# Altium project DAQ_2025.PrjPcb
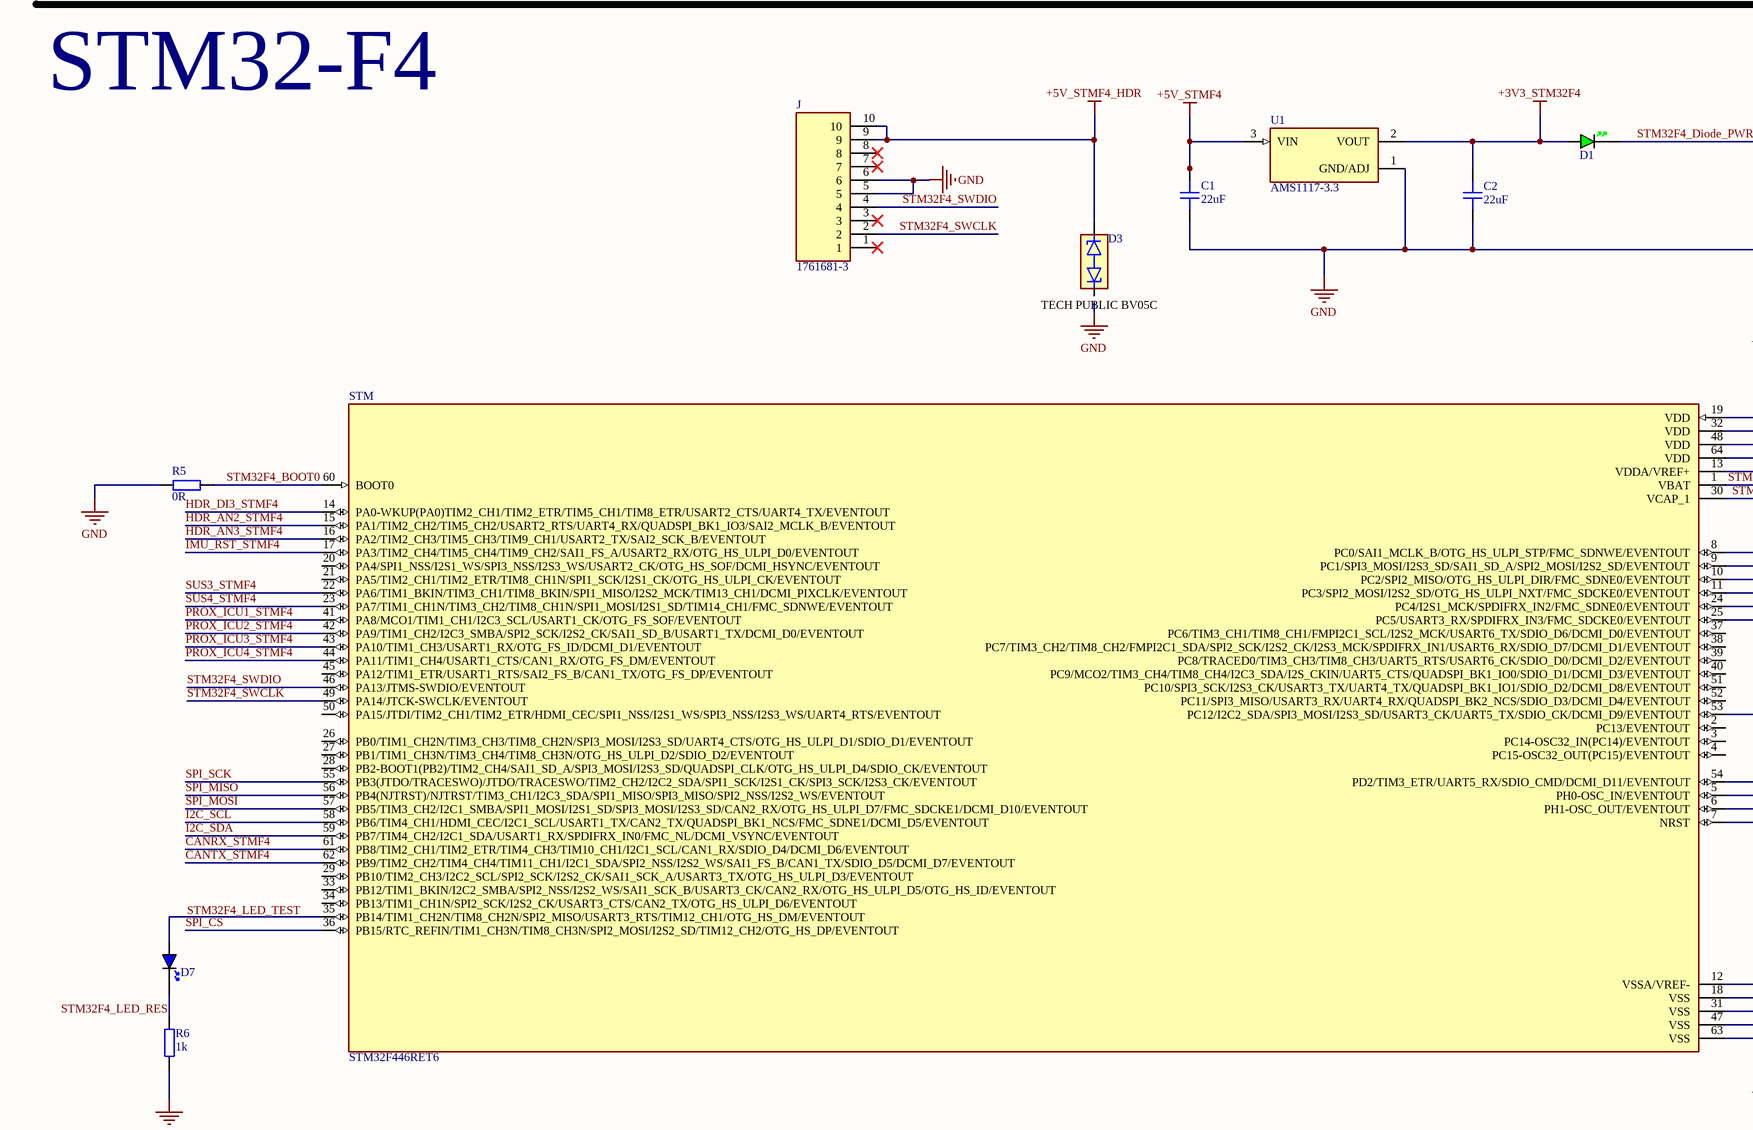
[diagram p0: DAQ_Sch.SchDoc, top left]
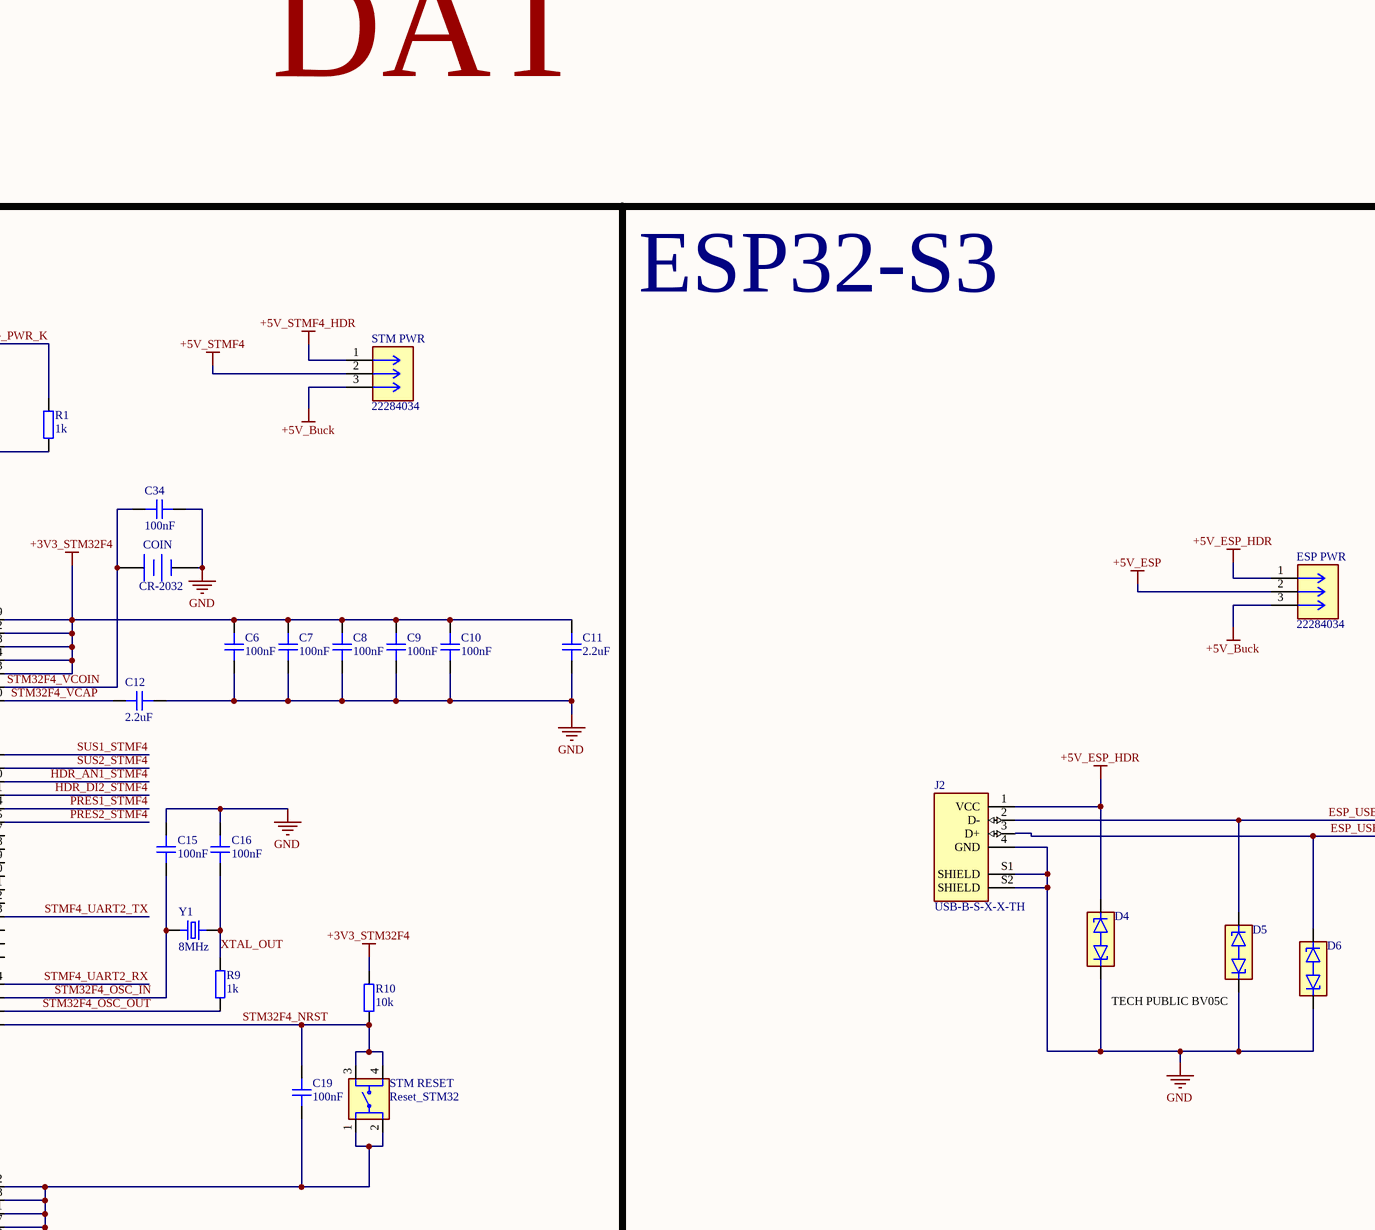
[diagram p1: DAQ_Sch.SchDoc, top middle]
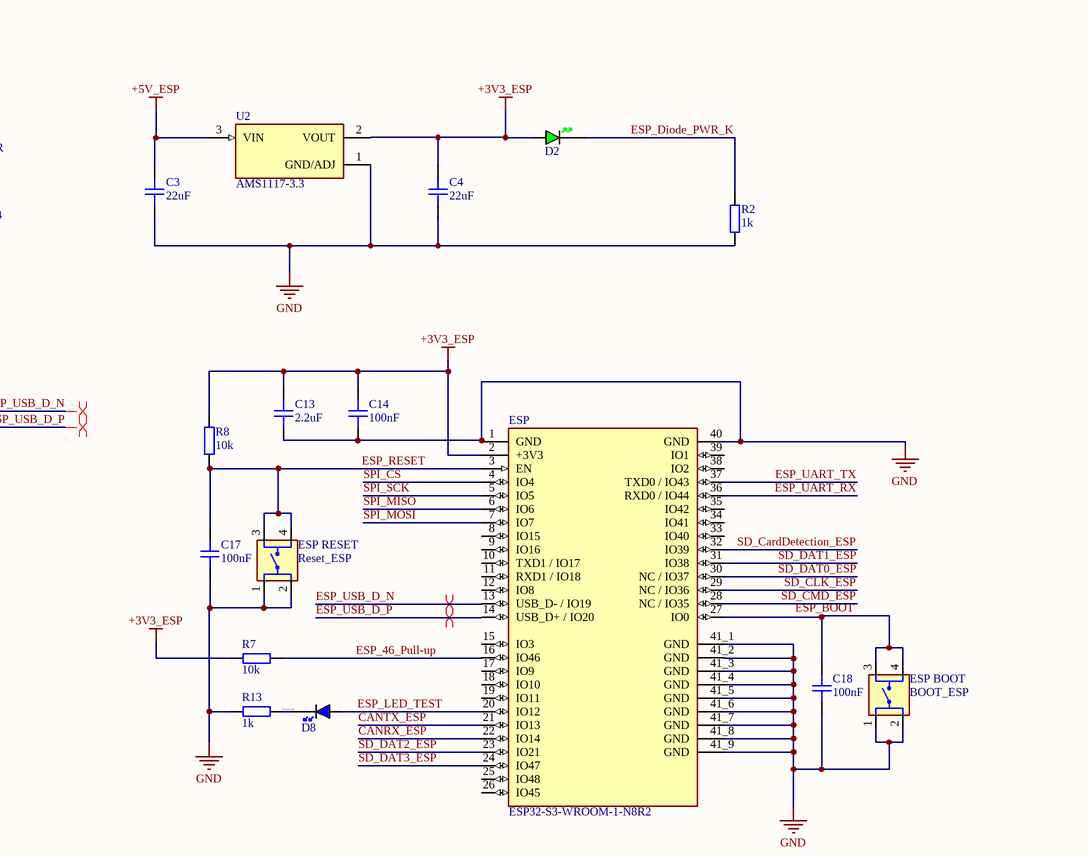
[diagram p2: DAQ_Sch.SchDoc, top right]
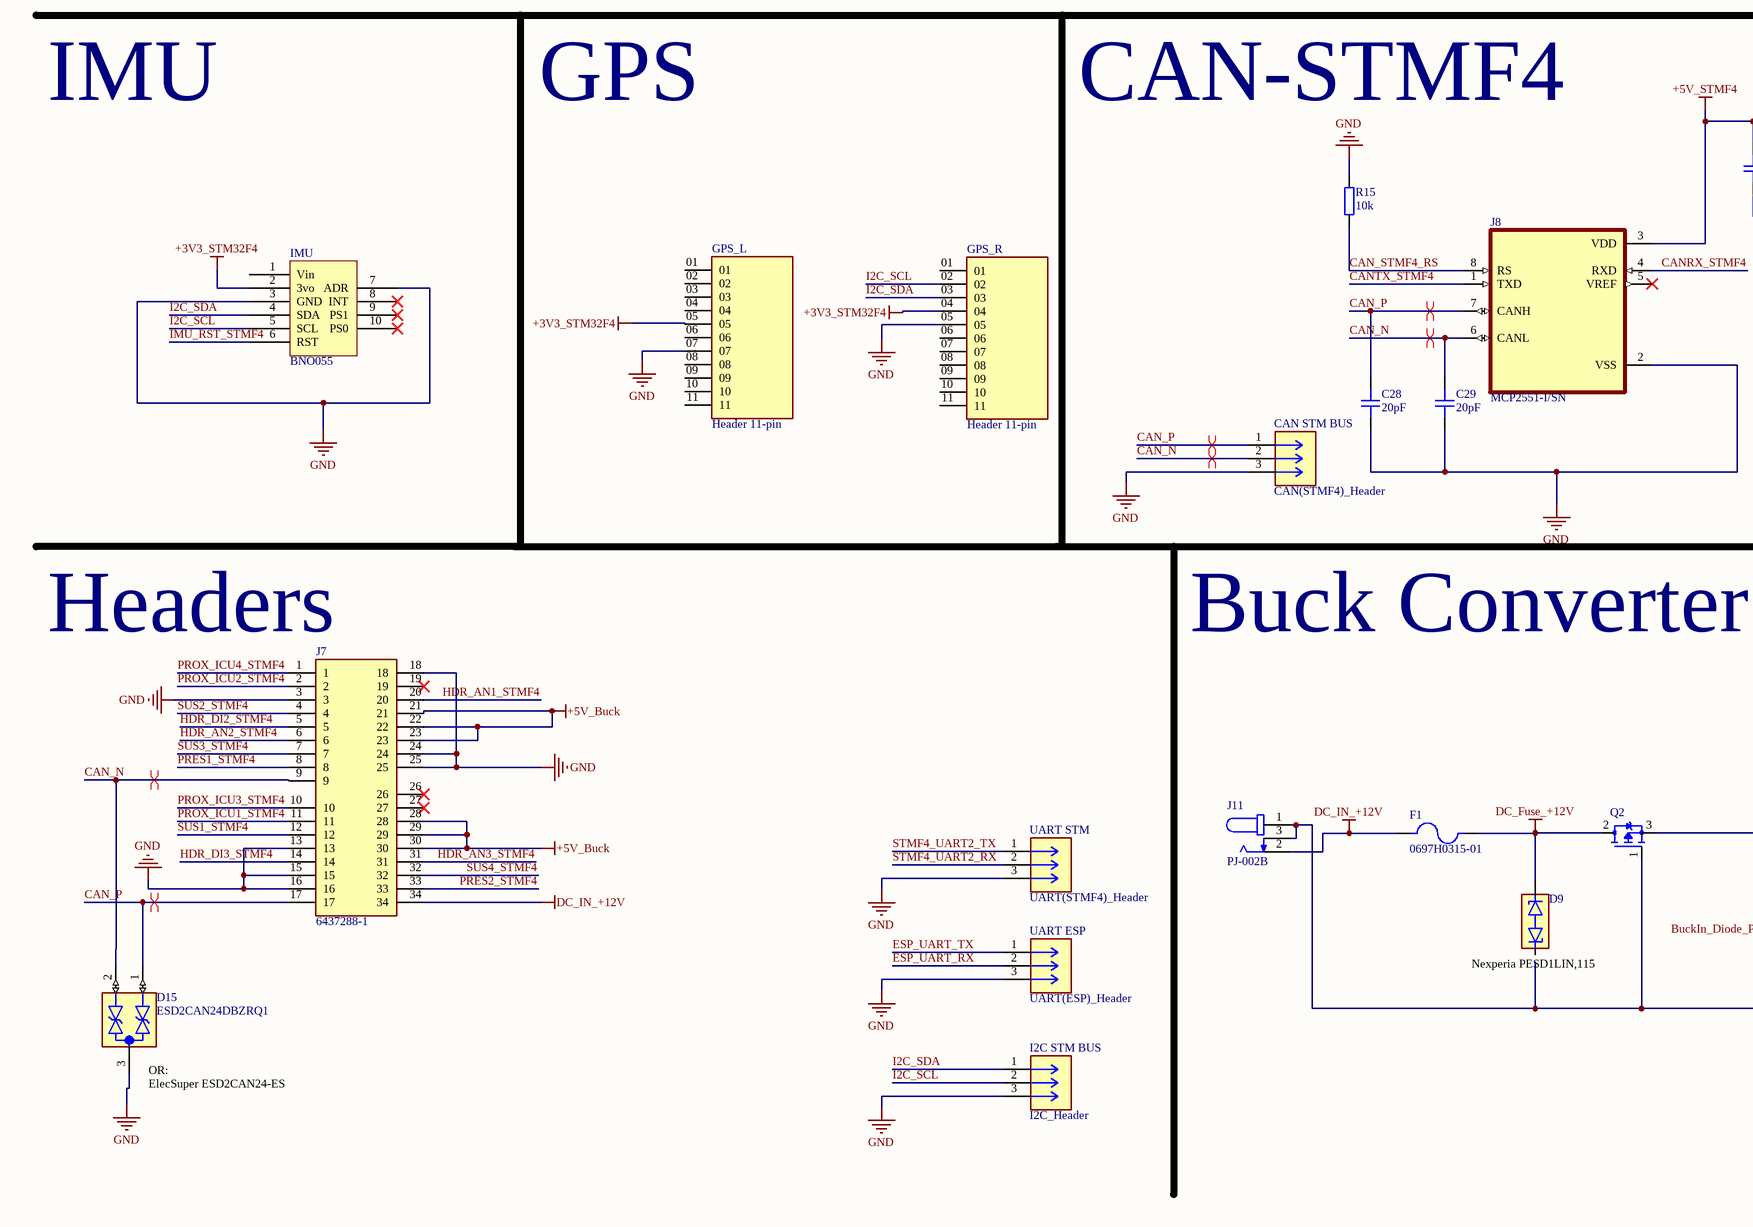
[diagram p3: DAQ_Sch.SchDoc, bottom left]
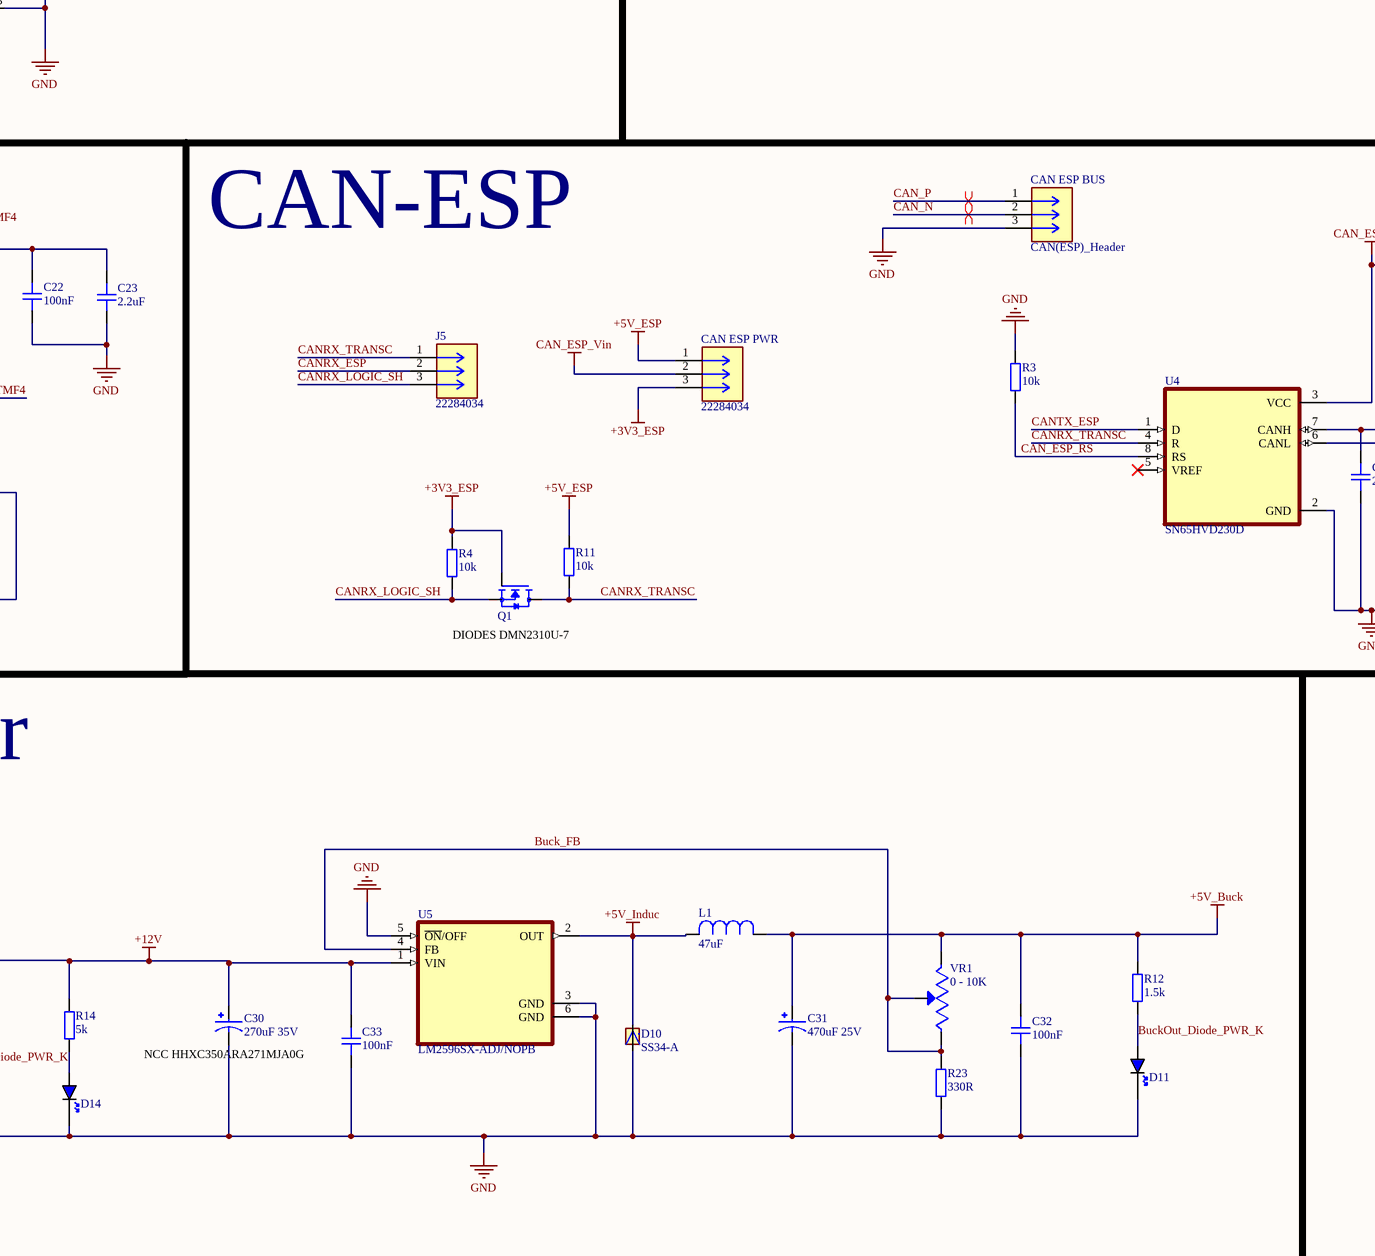
[diagram p4: DAQ_Sch.SchDoc, bottom middle]
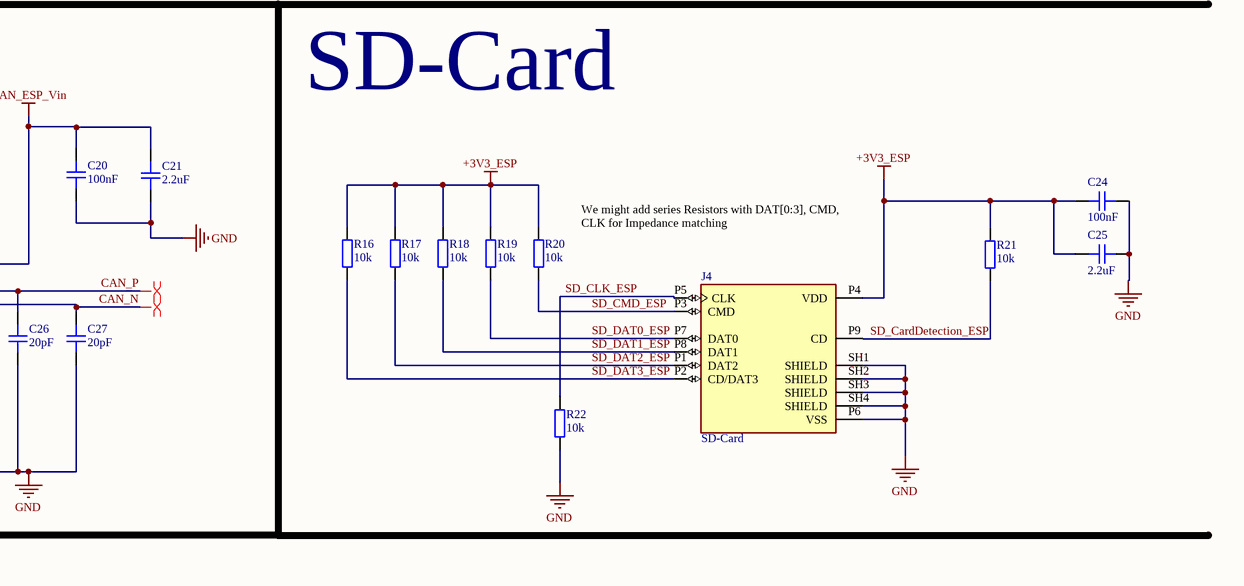
[diagram p5: DAQ_Sch.SchDoc, bottom right]
1 sheet, 103 parts. Net scope: global (net labels, ports and power ports of the same name join across sheets).
Board file: DAQ_Doc.PcbDoc

## Sheet DAQ_Sch.SchDoc
size D; SheetNumber: 1; SheetTotal: 1

### Parts
C1  22uF  [CAP_0805]
C2  22uF  [CAP_0805]
C3  22uF  [CAP_0805]
C4  22uF  [CAP_0805]
C6  100nF  [CAP_0805]
C7  100nF  [CAP_0805]
C8  100nF  [CAP_0805]
C9  100nF  [CAP_0805]
C10  100nF  [CAP_0805]
C11  2.2uF  [CAP_0805]
C12  2.2uF  [CAP_0805]
C13  2.2uF  [CAP_0805]
C14  100nF  [CAP_0805]
C15  100nF  [CAP_0805]
C16  100nF  [CAP_0805]
C17  100nF  [CAP_0805]
C18  100nF  [CAP_0805]
C19  100nF  [CAP_0805]
C20  100nF  [CAP_0805]
C21  2.2uF  [CAP_0805]
C22  100nF  [CAP_0805]
C23  2.2uF  [CAP_0805]
C24  100nF  [CAP_0805]
C25  2.2uF  [CAP_0805]
C26  20pF  [CAP_0805]
C27  20pF  [CAP_0805]
C28  20pF  [CAP_0805]
C29  20pF  [CAP_0805]
C30  270uF 35V  [CAP_EEEFT1E471AP]
C31  470uF 25V  [CAP_EEEFT1E471AP]
C32  100nF  [CAP_0805]
C33  100nF  [CAP_0805]
C34  100nF  [CAP_0805]
CAN_ESP_BUS  CAN(ESP)_Header  [CONN_SD-42375-001_M320_03_MOL]
CAN_ESP_PWR  22284034  [CONN_SD-42375-001_M320_03_MOL]
CAN_STM_BUS  CAN(STMF4)_Header  [CONN_SD-42375-001_M320_03_MOL]
COIN  CR-2032  [PANA-CR-2032HFN]
D1  GREEN  [LED_0805_GREEN]  (value not drawn)
D2  GREEN  [LED_0805_GREEN]  (value not drawn)
D3  5V-TVS  [DIO_PESD1LIN]  (value not drawn)
D4  5V-TVS  [DIO_PESD1LIN]  (value not drawn)
D5  5V-TVS  [DIO_PESD1LIN]  (value not drawn)
D6  5V-TVS  [DIO_PESD1LIN]  (value not drawn)
D7  BLUE  [LED_0805_BLUE]  (value not drawn)
D8  BLUE  [LED_0805_BLUE]  (value not drawn)
D9  5V-TVS  [DIO_PESD1LIN]  (value not drawn)
D10  SS34-A  [DO-214AC]
D11  BLUE  [LED_0805_BLUE]  (value not drawn)
D14  BLUE  [LED_0805_BLUE]  (value not drawn)
D15  ESD2CAN24DBZRQ1  [SOT95P237X112-3N]
ESP  ESP32-S3-WROOM-1-N8R2  [ESP32-S3-WROOM-1_NO-KEEPOUT]
ESP_BOOT  BOOT_ESP  [SW_FSM8JH]
ESP_PWR  22284034  [CONN_SD-42375-001_M320_03_MOL]
ESP_RESET  Reset_ESP  [SW_FSM8JH]
F1  0697H0315-01  [FUSRR508W60L835T400H810]
GPS_L  Header 11-pin  [SAMTEC_MTSW-111-22-T-S-440]
GPS_R  Header 11-pin  [SAMTEC_MTSW-111-22-T-S-440]
I2C_STM_BUS  I2C_Header  [CONN_SD-42375-001_M320_03_MOL]
IMU  BNO055  [IMU]
J  1761681-3  [TE_1761681-3]
J2  USB-B-S-X-X-TH  [SAMTEC_USB-B-S-X-X-TH]
J4  SD-Card  [GCT_MEM2075-00-140-01-A]
J5  22284034  [CONN_SD-42375-001_M320_03_MOL]
J7  6437288-1  [TE_6437288-1]
J8  MCP2551-I/SN  [SOIC127P599X175-8N]
J11  PJ-002B  [CUI_PJ-002B]
L1  47uF  [IND_CDRH127/LDNP-470MC_SUM]
Q1  2N7002  [TRANS_2N7002]  (value not drawn)
Q2  IRF4905STRRPBF  [TRANS_IRF4905STRRPBF]  (value not drawn)
R1  1k  [RES_0805]
R2  1k  [RES_0805]
R3  10k  [RES_0805]
R4  10k  [RES_0805]
R5  0R  [RES_0805]
R6  1k  [RES_0805]
R7  10k  [RES_0805]
R8  10k  [RES_0805]
R9  1k  [RES_0805]
R10  10k  [RES_0805]
R11  10k  [RES_0805]
R12  1.5k  [RES_0805]
R13  1k  [RES_0805]
R14  5k  [RES_0805]
R15  10k  [RES_0805]
R16  10k  [RES_0805]
R17  10k  [RES_0805]
R18  10k  [RES_0805]
R19  10k  [RES_0805]
R20  10k  [RES_0805]
R21  10k  [RES_0805]
R22  10k  [RES_0805]
R23  330R  [RES_0805]
STM  STM32F446RET6  [QFP50P1200X1200X160-64N]
STM_PWR  22284034  [CONN_SD-42375-001_M320_03_MOL]
STM_RESET  Reset_STM32  [SW_FSM8JH]
U1  AMS1117-3.3  [SOT229P700X180-4N]
U2  AMS1117-3.3  [SOT229P700X180-4N]
U4  SN65HVD230D  [SOIC127P599X175-8N]
U5  LM2596SX-ADJ/NOPB  [VREG_LM2596SX-ADJ/NOPB]
UART_ESP  UART(ESP)_Header  [CONN_SD-42375-001_M320_03_MOL]
UART_STM  UART(STMF4)_Header  [CONN_SD-42375-001_M320_03_MOL]
VR1  0 - 10K  [TRIM_3296W-1-103LF]
Y1  8MHz  [XTAL_ECS-80-20-5PVX]

### Nets
+3V3_ESP: C4.2 C13.1 C14.1 C24.2 C25.2 CAN_ESP_PWR.3 D2.A ESP.2(+3V3) J4.P4(VDD) Q1.1(G) R4.2 R7.1 R8.2 R16.2 R17.2 R18.2 R19.2 R20.2 R21.2 U2.2(VOUT)
+3V3_STM32F4: C2.2 C6.2 C7.2 C8.2 C9.2 C10.2 C11.2 D1.A GPS_L.05 GPS_R.04 IMU.2(3vo) R10.2 STM.13(VDDA/VREF+) STM.19(VDD) STM.32(VDD) STM.48(VDD) STM.64(VDD) U1.2(VOUT)
+5V_Buck: C31.1 C32.2 ESP_PWR.3 J7.21 J7.22 J7.23 J7.28 J7.29 J7.30 L1.1 R12.2 STM_PWR.3 VR1.3(CW)
+5V_ESP: C3.2 CAN_ESP_PWR.1 ESP_PWR.2 R11.2 U2.3(VIN)
+5V_ESP_HDR: D4.2 ESP_PWR.1 J2.1(VCC)
+5V_Induc: D10.C L1.2 U5.2(OUT)
+5V_STMF4: C1.2 C22.2 C23.2 J8.3(VDD) STM_PWR.2 U1.3(VIN)
+5V_STMF4_HDR: D3.2 J.9 J.10 STM_PWR.1
+12V: C30.1 C33.2 Q2.3(S) R14.2 U5.1(VIN)
CAN_ESP_Vin: C20.2 C21.2 CAN_ESP_PWR.2 U4.3(VCC)
DC_Fuse_+12V: D9.2 F1.2 Q2.2(D)
DC_IN_+12V: F1.1 J7.34 J11.2
GND: C1.1 C2.1 C3.1 C4.1 C6.1 C7.1 C8.1 C9.1 C10.1 C11.1 C12.1 C13.2 C14.2 C15.2 C16.2 C17.2 C18.2 C19.1 C20.1 C21.1 C22.1 C23.1 C24.1 C25.1 C26.1 C27.1 C28.1 C29.1 C30.2 C31.2 C32.1 C33.1 C34.1 CAN_ESP_BUS.3 CAN_STM_BUS.3 COIN.2(-) D3.1 D4.1 D5.1 D6.1 D9.1 D10.A D11.K D14.K D15.3(GND) ESP.1(GND) ESP.40(GND) ESP.41_1(GND) ESP.41_2(GND) ESP.41_3(GND) ESP.41_4(GND) ESP.41_5(GND) ESP.41_6(GND) ESP.41_7(GND) ESP.41_8(GND) ESP.41_9(GND) ESP_BOOT.1 ESP_BOOT.2 ESP_RESET.1 ESP_RESET.2 GPS_L.07 GPS_R.05 I2C_STM_BUS.3 IMU.3(GND) IMU.7(ADR) J.5 J.6 J2.4(GND) J2.S1(SHIELD) J2.S2(SHIELD) J4.P6(VSS) J4.SH1(SHIELD) J4.SH2(SHIELD) J4.SH3(SHIELD) J4.SH4(SHIELD) J7.3 J7.13 J7.15 J7.16 J7.18 J7.24 J7.25 J8.2(VSS) J11.1 J11.3 Q2.1(G) R1.1 R2.2 R3.2 R5.1 R6.1 R13.2 R15.2 R22.1 R23.1 STM.12(VSSA/VREF-) STM.18(VSS) STM.31(VSS) STM.47(VSS) STM.63(VSS) STM_RESET.1 STM_RESET.2 U1.1(GND/ADJ) U2.1(GND/ADJ) U4.2(GND) U5.3(GND) U5.5(~{ON}/OFF) U5.6(GND) UART_ESP.3 UART_STM.3
Buck_FB: R23.2 U5.4(FB) VR1.1(CCW) VR1.2(WIPER)
BuckIn_Diode_PWR_K: D14.A R14.1
BuckOut_Diode_PWR_K: D11.A R12.1
CAN_ESP_RS: R3.1 U4.8(RS)
CAN_N: C27.2 C29.2 CAN_ESP_BUS.2 CAN_STM_BUS.2 D15.2(IO2) J7.9 J8.6(CANL) U4.6(CANL)
CAN_P: C26.2 C28.2 CAN_ESP_BUS.1 CAN_STM_BUS.1 D15.1(IO1) J7.17 J8.7(CANH) U4.7(CANH)
CAN_STMF4_RS: J8.8(RS) R15.1
CANRX_ESP: ESP.22(IO14) J5.2
CANRX_LOGIC_SH: J5.3 Q1.2(S) R4.1
CANRX_STMF4: J8.4(RXD) STM.61(PB8/TIM2_CH1/TIM2_ETR/TIM4_CH3/TIM10_CH1/I2C1_SCL/CAN1_RX/SDIO_D4/DCMI_D6/EVENTOUT)
CANRX_TRANSC: J5.1 Q1.3(D) R11.1 U4.4(R)
CANTX_ESP: ESP.21(IO13) U4.1(D)
CANTX_STMF4: J8.1(TXD) STM.62(PB9/TIM2_CH2/TIM4_CH4/TIM11_CH1/I2C1_SDA/SPI2_NSS/I2S2_WS/SAI1_FS_B/CAN1_TX/SDIO_D5/DCMI_D7/EVENTOUT)
ESP_46_Pull-up: ESP.16(IO46) R7.2
ESP_BOOT: C18.1 ESP.27(IO0) ESP_BOOT.3 ESP_BOOT.4
ESP_Diode_PWR_K: D2.K R2.1
ESP_LED_RES: D8.K R13.1
ESP_LED_TEST: D8.A ESP.20(IO12)
ESP_RESET: C17.1 ESP.3(EN) ESP_RESET.3 ESP_RESET.4 R8.1
ESP_UART_RX: ESP.36(RXD0_/_IO44) UART_ESP.2
ESP_UART_TX: ESP.37(TXD0_/_IO43) UART_ESP.1
ESP_USB_D_N: D5.2 ESP.13(USB_D-_/_IO19) J2.2(D-)
ESP_USB_D_P: D6.2 ESP.14(USB_D+_/_IO20) J2.3(D+)
HDR_AN1_STMF4: J7.20 STM.10(PC2/SPI2_MISO/OTG_HS_ULPI_DIR/FMC_SDNE0/EVENTOUT)
HDR_AN2_STMF4: J7.6 STM.15(PA1/TIM2_CH2/TIM5_CH2/USART2_RTS/UART4_RX/QUADSPI_BK1_IO3/SAI2_MCLK_B/EVENTOUT)
HDR_AN3_STMF4: J7.31 STM.16(PA2/TIM2_CH3/TIM5_CH3/TIM9_CH1/USART2_TX/SAI2_SCK_B/EVENTOUT)
HDR_DI2_STMF4: J7.5 STM.11(PC3/SPI2_MOSI/I2S2_SD/OTG_HS_ULPI_NXT/FMC_SDCKE0/EVENTOUT)
HDR_DI3_STMF4: J7.14 STM.14(PA0-WKUP(PA0)TIM2_CH1/TIM2_ETR/TIM5_CH1/TIM8_ETR/USART2_CTS/UART4_TX/EVENTOUT)
I2C_SCL: GPS_R.02 I2C_STM_BUS.2 IMU.5(SCL) STM.58(PB6/TIM4_CH1/HDMI_CEC/I2C1_SCL/USART1_TX/CAN2_TX/QUADSPI_BK1_NCS/FMC_SDNE1/DCMI_D5/EVENTOUT)
I2C_SDA: GPS_R.03 I2C_STM_BUS.1 IMU.4(SDA) STM.59(PB7/TIM4_CH2/I2C1_SDA/USART1_RX/SPDIFRX_IN0/FMC_NL/DCMI_VSYNC/EVENTOUT)
IMU_RST_STMF4: IMU.6(RST) STM.17(PA3/TIM2_CH4/TIM5_CH4/TIM9_CH2/SAI1_FS_A/USART2_RX/OTG_HS_ULPI_D0/EVENTOUT)
PRES1_STMF4: J7.8 STM.24(PC4/I2S1_MCK/SPDIFRX_IN2/FMC_SDNE0/EVENTOUT)
PRES2_STMF4: J7.33 STM.25(PC5/USART3_RX/SPDIFRX_IN3/FMC_SDCKE0/EVENTOUT)
PROX_ICU1_STMF4: J7.11 STM.41(PA8/MCO1/TIM1_CH1/I2C3_SCL/USART1_CK/OTG_FS_SOF/EVENTOUT)
PROX_ICU2_STMF4: J7.2 STM.42(PA9/TIM1_CH2/I2C3_SMBA/SPI2_SCK/I2S2_CK/SAI1_SD_B/USART1_TX/DCMI_D0/EVENTOUT)
PROX_ICU3_STMF4: J7.10 STM.43(PA10/TIM1_CH3/USART1_RX/OTG_FS_ID/DCMI_D1/EVENTOUT)
PROX_ICU4_STMF4: J7.1 STM.44(PA11/TIM1_CH4/USART1_CTS/CAN1_RX/OTG_FS_DM/EVENTOUT)
SD_CardDetection_ESP: ESP.32(IO39) J4.P9(CD) R21.1
SD_CLK_ESP: ESP.29(NC_/_IO36) J4.P5(CLK) R22.2
SD_CMD_ESP: ESP.28(NC_/_IO35) J4.P3(CMD) R20.1
SD_DAT0_ESP: ESP.30(NC_/_IO37) J4.P7(DAT0) R19.1
SD_DAT1_ESP: ESP.31(IO38) J4.P8(DAT1) R18.1
SD_DAT2_ESP: ESP.23(IO21) J4.P1(DAT2) R17.1
SD_DAT3_ESP: ESP.24(IO47) J4.P2(CD/DAT3) R16.1
SPI_CS: ESP.4(IO4) STM.36(PB15/RTC_REFIN/TIM1_CH3N/TIM8_CH3N/SPI2_MOSI/I2S2_SD/TIM12_CH2/OTG_HS_DP/EVENTOUT)
SPI_MISO: ESP.6(IO6) STM.56(PB4(NJTRST)/NJTRST/TIM3_CH1/I2C3_SDA/SPI1_MISO/SPI3_MISO/SPI2_NSS/I2S2_WS/EVENTOUT)
SPI_MOSI: ESP.7(IO7) STM.57(PB5/TIM3_CH2/I2C1_SMBA/SPI1_MOSI/I2S1_SD/SPI3_MOSI/I2S3_SD/CAN2_RX/OTG_HS_ULPI_D7/FMC_SDCKE1/DCMI_D10/EVENTOUT)
SPI_SCK: ESP.5(IO5) STM.55(PB3(JTDO/TRACESWO)/JTDO/TRACESWO/TIM2_CH2/I2C2_SDA/SPI1_SCK/I2S1_CK/SPI3_SCK/I2S3_CK/EVENTOUT)
STM32F4_BOOT0: R5.2 STM.60(BOOT0)
STM32F4_Diode_PWR_K: D1.K R1.2
STM32F4_LED_RES: D7.K R6.2
STM32F4_NRST: C19.2 R10.1 STM.7(NRST) STM_RESET.3 STM_RESET.4
STM32F4_OSC_IN: C15.1 STM.5(PH0-OSC_IN/EVENTOUT) Y1.2
STM32F4_OSC_OUT: R9.1 STM.6(PH1-OSC_OUT/EVENTOUT)
STM32F4_SWCLK: J.2 STM.49(PA14/JTCK-SWCLK/EVENTOUT)
STM32F4_SWDIO: J.4 STM.46(PA13/JTMS-SWDIO/EVENTOUT)
STM32F4_VCAP: C12.2 STM.30(VCAP_1)
STM32F4_VCOIN: C34.2 COIN.1(+) STM.1(VBAT)
STMF4_UART2_RX: STM.54(PD2/TIM3_ETR/UART5_RX/SDIO_CMD/DCMI_D11/EVENTOUT) UART_STM.2
STMF4_UART2_TX: STM.53(PC12/I2C2_SDA/SPI3_MOSI/I2S3_SD/USART3_CK/UART5_TX/SDIO_CK/DCMI_D9/EVENTOUT) UART_STM.1
SUS1_STMF4: J7.12 STM.8(PC0/SAI1_MCLK_B/OTG_HS_ULPI_STP/FMC_SDNWE/EVENTOUT)
SUS2_STMF4: J7.4 STM.9(PC1/SPI3_MOSI/I2S3_SD/SAI1_SD_A/SPI2_MOSI/I2S2_SD/EVENTOUT)
SUS3_STMF4: J7.7 STM.22(PA6/TIM1_BKIN/TIM3_CH1/TIM8_BKIN/SPI1_MISO/I2S2_MCK/TIM13_CH1/DCMI_PIXCLK/EVENTOUT)
SUS4_STMF4: J7.32 STM.23(PA7/TIM1_CH1N/TIM3_CH2/TIM8_CH1N/SPI1_MOSI/I2S1_SD/TIM14_CH1/FMC_SDNWE/EVENTOUT)
XTAL_OUT: C16.1 R9.2 Y1.1
NetD7_A: D7.A STM.35(PB14/TIM1_CH2N/TIM8_CH2N/SPI2_MISO/USART3_RTS/TIM12_CH1/OTG_HS_DM/EVENTOUT)

Not connected (* = marked no-connect by the designer): ESP 8(IO15) 9(IO16) 10(TXD1_/_IO17) 11(RXD1_/_IO18) 12(IO8) 15(IO3) 17(IO9) 18(IO10) 19(IO11) 25(IO48) 26(IO45) 33(IO40) 34(IO41) 35(IO42) 38(IO2) 39(IO1); GPS_L 01 02 03 04 06 08 09 10 11; GPS_R 01 06 07 08 09 10 11; IMU 1(Vin) 8(INT)* 9(PS1)* 10(PS0)*; J 1* 3* 7* 8*; J7 19* 26* 27*; J8 5(VREF)*; STM 2(PC13/EVENTOUT) 3(PC14-OSC32_IN(PC14)/EVENTOUT) 4(PC15-OSC32_OUT(PC15)/EVENTOUT) 20(PA4/SPI1_NSS/I2S1_WS/SPI3_NSS/I2S3_WS/USART2_CK/OTG_HS_SOF/DCMI_HSYNC/EVENTOUT) 21(PA5/TIM2_CH1/TIM2_ETR/TIM8_CH1N/SPI1_SCK/I2S1_CK/OTG_HS_ULPI_CK/EVENTOUT) 26(PB0/TIM1_CH2N/TIM3_CH3/TIM8_CH2N/SPI3_MOSI/I2S3_SD/UART4_CTS/OTG_HS_ULPI_D1/SDIO_D1/EVENTOUT) 27(PB1/TIM1_CH3N/TIM3_CH4/TIM8_CH3N/OTG_HS_ULPI_D2/SDIO_D2/EVENTOUT) 28(PB2-BOOT1(PB2)/TIM2_CH4/SAI1_SD_A/SPI3_MOSI/I2S3_SD/QUADSPI_CLK/OTG_HS_ULPI_D4/SDIO_CK/EVENTOUT) 29(PB10/TIM2_CH3/I2C2_SCL/SPI2_SCK/I2S2_CK/SAI1_SCK_A/USART3_TX/OTG_HS_ULPI_D3/EVENTOUT) 33(PB12/TIM1_BKIN/I2C2_SMBA/SPI2_NSS/I2S2_WS/SAI1_SCK_B/USART3_CK/CAN2_RX/OTG_HS_ULPI_D5/OTG_HS_ID/EVENTOUT) 34(PB13/TIM1_CH1N/SPI2_SCK/I2S2_CK/USART3_CTS/CAN2_TX/OTG_HS_ULPI_D6/EVENTOUT) 37(PC6/TIM3_CH1/TIM8_CH1/FMPI2C1_SCL/I2S2_MCK/USART6_TX/SDIO_D6/DCMI_D0/EVENTOUT) 38(PC7/TIM3_CH2/TIM8_CH2/FMPI2C1_SDA/SPI2_SCK/I2S2_CK/I2S3_MCK/SPDIFRX_IN1/USART6_RX/SDIO_D7/DCMI_D1/EVENTOUT) 39(PC8/TRACED0/TIM3_CH3/TIM8_CH3/UART5_RTS/USART6_CK/SDIO_D0/DCMI_D2/EVENTOUT) 40(PC9/MCO2/TIM3_CH4/TIM8_CH4/I2C3_SDA/I2S_CKIN/UART5_CTS/QUADSPI_BK1_IO0/SDIO_D1/DCMI_D3/EVENTOUT) 45(PA12/TIM1_ETR/USART1_RTS/SAI2_FS_B/CAN1_TX/OTG_FS_DP/EVENTOUT) 50(PA15/JTDI/TIM2_CH1/TIM2_ETR/HDMI_CEC/SPI1_NSS/I2S1_WS/SPI3_NSS/I2S3_WS/UART4_RTS/EVENTOUT) 51(PC10/SPI3_SCK/I2S3_CK/USART3_TX/UART4_TX/QUADSPI_BK1_IO1/SDIO_D2/DCMI_D8/EVENTOUT) 52(PC11/SPI3_MISO/USART3_RX/UART4_RX/QUADSPI_BK2_NCS/SDIO_D3/DCMI_D4/EVENTOUT); U4 5(VREF)*

### Layout directives
differential pair: CAN_N, CAN_P, ESP_USB_D_N, ESP_USB_D_P

### Notes on the sheet
- DAT
- STM32-F4
- ESP32-S3
- (near D3) TECH PUBLIC BV05C
- (near D5) TECH PUBLIC BV05C
- IMU
- GPS
- CAN-STMF4
- CAN-ESP
- SD-Card
- We might add series Resistors with DAT[0:3], CMD, CLK for Impedance matching
- (near Q1) DIODES DMN2310U-7
- (near J7) Headers
- Buck Converter
- (near D9) Nexperia PESD1LIN,115
- (near C30) NCC HHXC350ARA271MJA0G
- (near D15) OR:
  ElecSuper ESD2CAN24-ES
- Labels drawn without touching a wire or pin: STM32F4_LED_TEST

### Library data of the parts
C1-C4 C6-C29 C32-C34 = CAP_0805: Capacitor SMD 0805; Manufacturer: *; Manufacturer Part Number: *; Distributor Link: *; LCSC: *; Rating: *; Dielectric: *
C30 = EEEFT1E471AP: 35V ±20% 270uF SMD,D10xL10mm Hybrid Aluminum Electrolytic Capacitors ROHS; MF: Panasonic; SnapEDA_Link: https://www.snapeda.com/parts/EEEFT1E471AP/Panasonic/view-part/?ref=snap; Package: RADIAL-2 Panasonic; Value: *; MP: EEEFT1E471AP; Check_prices: https://www.snapeda.com/parts/EEEFT1E471AP/Panasonic/view-part/?ref=eda
C31 = EEEFT1E471AP: Cap Aluminum Lytic 470uF 25V 20% (8 X 10.2mm) SMD 0.08 Ohm 850mA 2000h 105C Automotive T/R; MF: Panasonic; SnapEDA_Link: https://www.snapeda.com/parts/EEEFT1E471AP/Panasonic/view-part/?ref=snap; Package: RADIAL-2 Panasonic; Value: *; MP: EEEFT1E471AP; Check_prices: https://www.snapeda.com/parts/EEEFT1E471AP/Panasonic/view-part/?ref=eda
CAN_ESP_BUS CAN_STM_BUS I2C_STM_BUS UART_ESP UART_STM = 22284034: Package: None; Price: None; Value: *; MP: 22284034; Availability: Unavailable
COIN = CMP-2000-05296-1: Coin Cell Battery, 225 mAh, 0.2 mA, 3 V, -30 to 60 degC, Bulk; Manufacturer: Panasonic; SVHC: 1,2-dimethoxyethane,ethyleneglycoldimethylether(EGDME)(15-Jun-2015); Battery Size Code: 2032; Battery Voltage: 3V; Battery IEC Code: CR2032; Battery NEDA Code: 5004LC; External Height: 3.2mm; Battery Terminals: PCBPins; Battery Capacity: 220mAh; External Diameter: 20mm; Battery Technology: LithiumManganeseDioxide; Product Range: -; Datasheet Version: Rev. 0, 05/2010; Manufacturer URL: http://www.panasonic.com/; External Depth: -; Weight: 2.9g; Datasheet URL: https://datasheet.ciiva.com/3/aaa4000de87-3072.pdf; External Width: -
D1 D2 = LED_0805_GREEN: LED 0805 GREEN SMD; Manufacturer: *; Manufacturer Part Number: *; Distributor Link: *; LCSC: *
D3-D6 = PESD1LIN: 10A 8V Bidirectional 5V SOD-323 ESD and Surge Protection (TVS/ESD) ROHS; MF: Nexperia USA; SnapEDA_Link: https://www.snapeda.com/parts/PESD1LIN/Nexperia/view-part/?ref=snap; Package: SOD-323 Vishay Semiconductor Diodes Division; Value: *; MP: PESD1LIN; Check_prices: https://www.snapeda.com/parts/PESD1LIN/Nexperia/view-part/?ref=eda
D7 D8 D11 D14 = LED_0805_BLUE: LED 0805 BLUE SMD; Manufacturer: *; Manufacturer Part Number: *; Distributor Link: *; LCSC: *
D9 = PESD1LIN: 44V, 70V Clamp 3A (8/20Âµs) Ipp Tvs Diode Surface Mount SOD-323; MF: Nexperia USA; SnapEDA_Link: https://www.snapeda.com/parts/PESD1LIN/Nexperia/view-part/?ref=snap; Package: SOD-323 Vishay Semiconductor Diodes Division; Value: *; MP: PESD1LIN; Check_prices: https://www.snapeda.com/parts/PESD1LIN/Nexperia/view-part/?ref=eda
D10 = SS34-A: Schottky barrier diode, 3A, 40V; MF: hy electronic corp; MP: SS34A; SnapEDA_Link: https://www.snapeda.com/parts/SS34A/HY+Electronic/view-part/?ref=snap; Package: None; Value: *; Check_prices: https://www.snapeda.com/parts/SS34A/HY+Electronic/view-part/?ref=eda
D15 = ESD2CAN24DBZRQ1: Automotive, dual, 3-pF, ±24-V, ±30-kV ESD protection diode for in-vehicle networks; MF: Texas Instruments; SnapEDA_Link: https://www.snapeda.com/parts/ESD2CAN24DBZRQ1/Texas+Instruments/view-part/?ref=snap; Package: SOT-23 Texas Instruments; Value: *; MP: ESD2CAN24DBZRQ1; Check_prices: https://www.snapeda.com/parts/ESD2CAN24DBZRQ1/Texas+Instruments/view-part/?ref=eda
ESP = ESP32-S3-WROOM-1: Multiprotocol Modules SMD Module, ESP32-S3R8, 3.3V, 8 MB Octal PSRAM Die, 16 MB Quad SPI Flash, PCB Antenna; MPN: ESP32-S3-WROOM-1-N16R2; MF: Espressif Systems; Supplier Link: https://www.digikey.com/en/products/detail/espressif-systems/ESP32-S3-WROOM-1-N16R2/16162644; Package: Module Espressif Systems; Value: *; Digi-Key_Part_Number: 1965-ESP32-S3-WROOM-1-N16R2TR-ND; Check_prices: https://www.snapeda.com/parts/ESP32-WROOM-32/Espressif+Systems/view-part/?ref=eda; SnapEDA_Link: https://www.snapeda.com/parts/ESP32-WROOM-32/Espressif+Systems/view-part/?ref=snap; Price: 3.98; Supplier: Digikey
ESP_BOOT ESP_RESET STM_RESET = FSM8JH: Tactile Switch SPST-NO Top Actuated Through Hole; MF: TE Connectivity; Check_prices: https://www.snapeda.com/parts/FSM8JH/TE+Connectivity+ALCOSWITCH+Switches/view-part/?ref=eda; Value: *; Availability: In Stock; MP: FSM8JH; Price: None; Package: None; SnapEDA_Link: https://www.snapeda.com/parts/FSM8JH/TE+Connectivity+ALCOSWITCH+Switches/view-part/?ref=snap
F1 = 0697H0315-01: 2-Pin Radial Fuse | Rectangular | Slow Blow | UL | 315mA; MF: Bel Fuse; SnapEDA_Link: https://www.snapeda.com/parts/0697H0315-01/Bel+Circuit+Protection/view-part/?ref=snap; Package: Radial Box  Bel Fuse; Value: *; MP: 0697H0315-01; Check_prices: https://www.snapeda.com/parts/0697H0315-01/Bel+Circuit+Protection/view-part/?ref=eda
GPS_L GPS_R = MTSW-111-22-T-S-440: MP: MTSW-111-22-T-S-440; Package: None; Price: None; Value: *; Availability: Unavailable
IMU = Component_1
J = 1761681-3: Conn Shrouded Header HDR 10 POS 2.54mm Solder ST Thru-Hole Tray; MF: TE Connectivity; Availability: Unavailable; SnapEDA_Link: https://www.snapeda.com/parts/1761681-3/TE%20Connectivity%20AMP%20Connectors/view-part/494554/?ref=snap; Price: None; MP: 1761681-3; Package: None; Value: *
J2 = USB-B-S-X-X-TH: USB-B (USB TYPE-B) USB 2.0 Receptacle Connector 4 Position Through Hole, Right Angle; MF: Samtec; MP: USB-B-S-F-W-TH-TR; SnapEDA_Link: https://www.snapeda.com/parts/USB-B-S-F-W-TH-TR/Samtec/view-part/?ref=snap; Package: None; Value: *; Check_prices: https://www.snapeda.com/parts/USB-B-S-F-W-TH-TR/Samtec/view-part/?ref=eda
J4 = MEM2075-00-140-01-A: 9 (8 + 1) Position Card Connector microSD Surface Mount, Right Angle Gold; MF: Global Connector Technology; SnapEDA_Link: https://www.snapeda.com/parts/MEM2075-00-140-01-A/Global+Connector+Technology/view-part/?ref=snap; Package: None; Value: *; MP: MEM2075-00-140-01-A; Check_prices: https://www.snapeda.com/parts/MEM2075-00-140-01-A/Global+Connector+Technology/view-part/?ref=eda
J7 = 6437288-1: Receptacle Connector, Gold, Pitch 3.0000 mm, AC Voltage 250 V, AMP Series | TE Connectivity 6437288-1; SnapEDA_Link: https://www.snapeda.com/parts/6437288-1/TE+Connectivity+AMP+Connectors/view-part/?ref=snap; Package: None; Value: *; MF: TE Connectivity; MP: 6437288-1; EU_RoHS_Compliance: Compliant; Check_prices: https://www.snapeda.com/parts/6437288-1/TE+Connectivity+AMP+Connectors/view-part/?ref=eda
J11 = PJ-002B: 2.5 x 6.5 mm, 2.5 A, Horizontal, Through Hole, Dc Power Jack Connector; MF: Same Sky; SnapEDA_Link: https://www.snapeda.com/parts/PJ-002B/Same+Sky/view-part/?ref=snap; Package: None; Value: *; MP: PJ-002B; Check_prices: https://www.snapeda.com/parts/PJ-002B/Same+Sky/view-part/?ref=eda
L1 = CDRH127/LDNP-470MC: Inductor Power Shielded Drum Core 47uH 20% 1KHz Ferrite 4.1A 0.078Ohm DCR T/R; MF: Sumida Corporation; SnapEDA_Link: https://www.snapeda.com/parts/CDRH127/LDNP-470MC/Sumida/view-part/?ref=snap; Package: Non Standard Sumida; Value: *; MP: CDRH127/LDNP-470MC; Check_prices: https://www.snapeda.com/parts/CDRH127/LDNP-470MC/Sumida/view-part/?ref=eda
Q1 = 2N7002: MOSFET, SOT-23, N, 60V, 0.28A, 5â„¦, 150Â°C; MF: Diotec Semiconductor; SnapEDA_Link: https://www.snapeda.com/parts/2N7002/Diotec/view-part/?ref=snap; Package: SOT-23 Diotec; Value: *; MP: 2N7002; Check_prices: https://www.snapeda.com/parts/2N7002/Diotec/view-part/?ref=eda
Q2 = IRF4905STRRPBF: RoHS Compliant | Low RDS(on) | Industry-leading quality | Dynamic dv/dt Rating | Fast Switching | Fully Avalanche Rated | 175C Operating Temperature | P-Channel MOSFET; MF: Infineon Technologies; Package: D2PAK Infineon; Price: None; Availability: In Stock; Purchase-URL: https://pricing.snapeda.com/search/part/IRF4905STRRPBF/?ref=eda; Check_prices: https://www.snapeda.com/parts/IRF4905STRRPBF/Infineon+Technologies/view-part/?ref=eda; MP: IRF4905STRRPBF; SnapEDA_Link: https://www.snapeda.com/parts/IRF4905STRRPBF/Infineon+Technologies/view-part/?ref=snap; Value: *
R1-R23 = RES_0805: Resistor SMD 0805; Manufacturer: *; Manufacturer Part Number: *; Distributor Link: *; LCSC: *
STM = STM32F446RET6: ARMÂ® CortexÂ®-M4 STM32F4 Microcontroller IC 32-Bit 180MHz 512KB _512K x 8_ FLASH 64-LQFP _10x10_; MF: STMicroelectronics; SnapEDA_Link: https://www.snapeda.com/parts/STM32F446RET6/STMicroelectronics/view-part/274209/?ref=snap; Price: None; MP: STM32F446RET6; Value: *; Availability: Unavailable; Package: LQFP-64 STMicroelectronics
U1 U2 = AMS1117-3.3: Sot223/Pkg 1-Amp 3.3-Volt Low Drop Out Voltage Regulatator; MF: Advanced Monolithic Systems; SnapEDA_Link: https://www.snapeda.com/parts/AMS1117-3.3/Advanced+Monolithic+Systems/view-part/?ref=snap; Package: SOT-223 Seeed Technology; Value: *; MP: AMS1117-3.3; Check_prices: https://www.snapeda.com/parts/AMS1117-3.3/Advanced+Monolithic+Systems/view-part/?ref=eda
U4 = SN65HVD230D: 3.3 V CAN Transceiver with Standby Mode; MF: Texas Instruments; SnapEDA_Link: https://www.snapeda.com/parts/SN65HVD230D/Texas+Instruments/view-part/?ref=snap; Package: SOIC-8 Texas Instruments; Value: *; MP: SN65HVD230D; Check_prices: https://www.snapeda.com/parts/SN65HVD230D/Texas+Instruments/view-part/?ref=eda
U5 = LM2596SX-ADJ/NOPB: Bá»™ Ä‘iá»u chá»‰nh háº¡ Ã¡p SIMPLE SWITCHERÂ® 4,5V Ä‘áº¿n 40V, 3A vá»›i sá»‘ lÆ°á»£ng thÃ nh pháº§n tháº¥p; MF: Texas Instruments; SnapEDA_Link: https://www.snapeda.com/parts/LM2596SX-ADJ/NOPB/Texas+Instruments/view-part/?ref=snap; Package: TO-263-5 Texas Instruments; Value: *; MP: LM2596SX-ADJ/NOPB; Check_prices: https://www.snapeda.com/parts/LM2596SX-ADJ/NOPB/Texas+Instruments/view-part/?ref=eda
VR1 = 3296W-1-103LF: Trimmer, Cermet, Rest 10 Kilohms, PCB, 25 Turns, Pwr-Rtg 0.5W, 3296 Series | Bourns 3296W-1-103LF; SnapEDA_Link: https://www.snapeda.com/parts/3296W-1-103LF/Bourns/view-part/?ref=snap; Package: NON STANDARD-3 Bourns; Value: *; MF: Bourns; MP: 3296W-1-103LF; Check_prices: https://www.snapeda.com/parts/3296W-1-103LF/Bourns/view-part/?ref=eda
Y1 = ECS-80-20-5PVX: SMD Quartz crystal; Package: None; Price: None; Value: *; MP: ECS-80-20-5PVX; Availability: Unavailable
CAN_ESP_PWR ESP_PWR J5 STM_PWR = 22284034: Package: None; Price: None; Value: *; MP: 22284034; Availability: Unavailable
J8 = MCP2551-I/SN: Package: None; MP: MCP2551-I/SN; Price: None; Availability: Unavailable; Value: *